# EAGLE design SD_MMC Breakout-v20 (EAGLE 8.1.0)
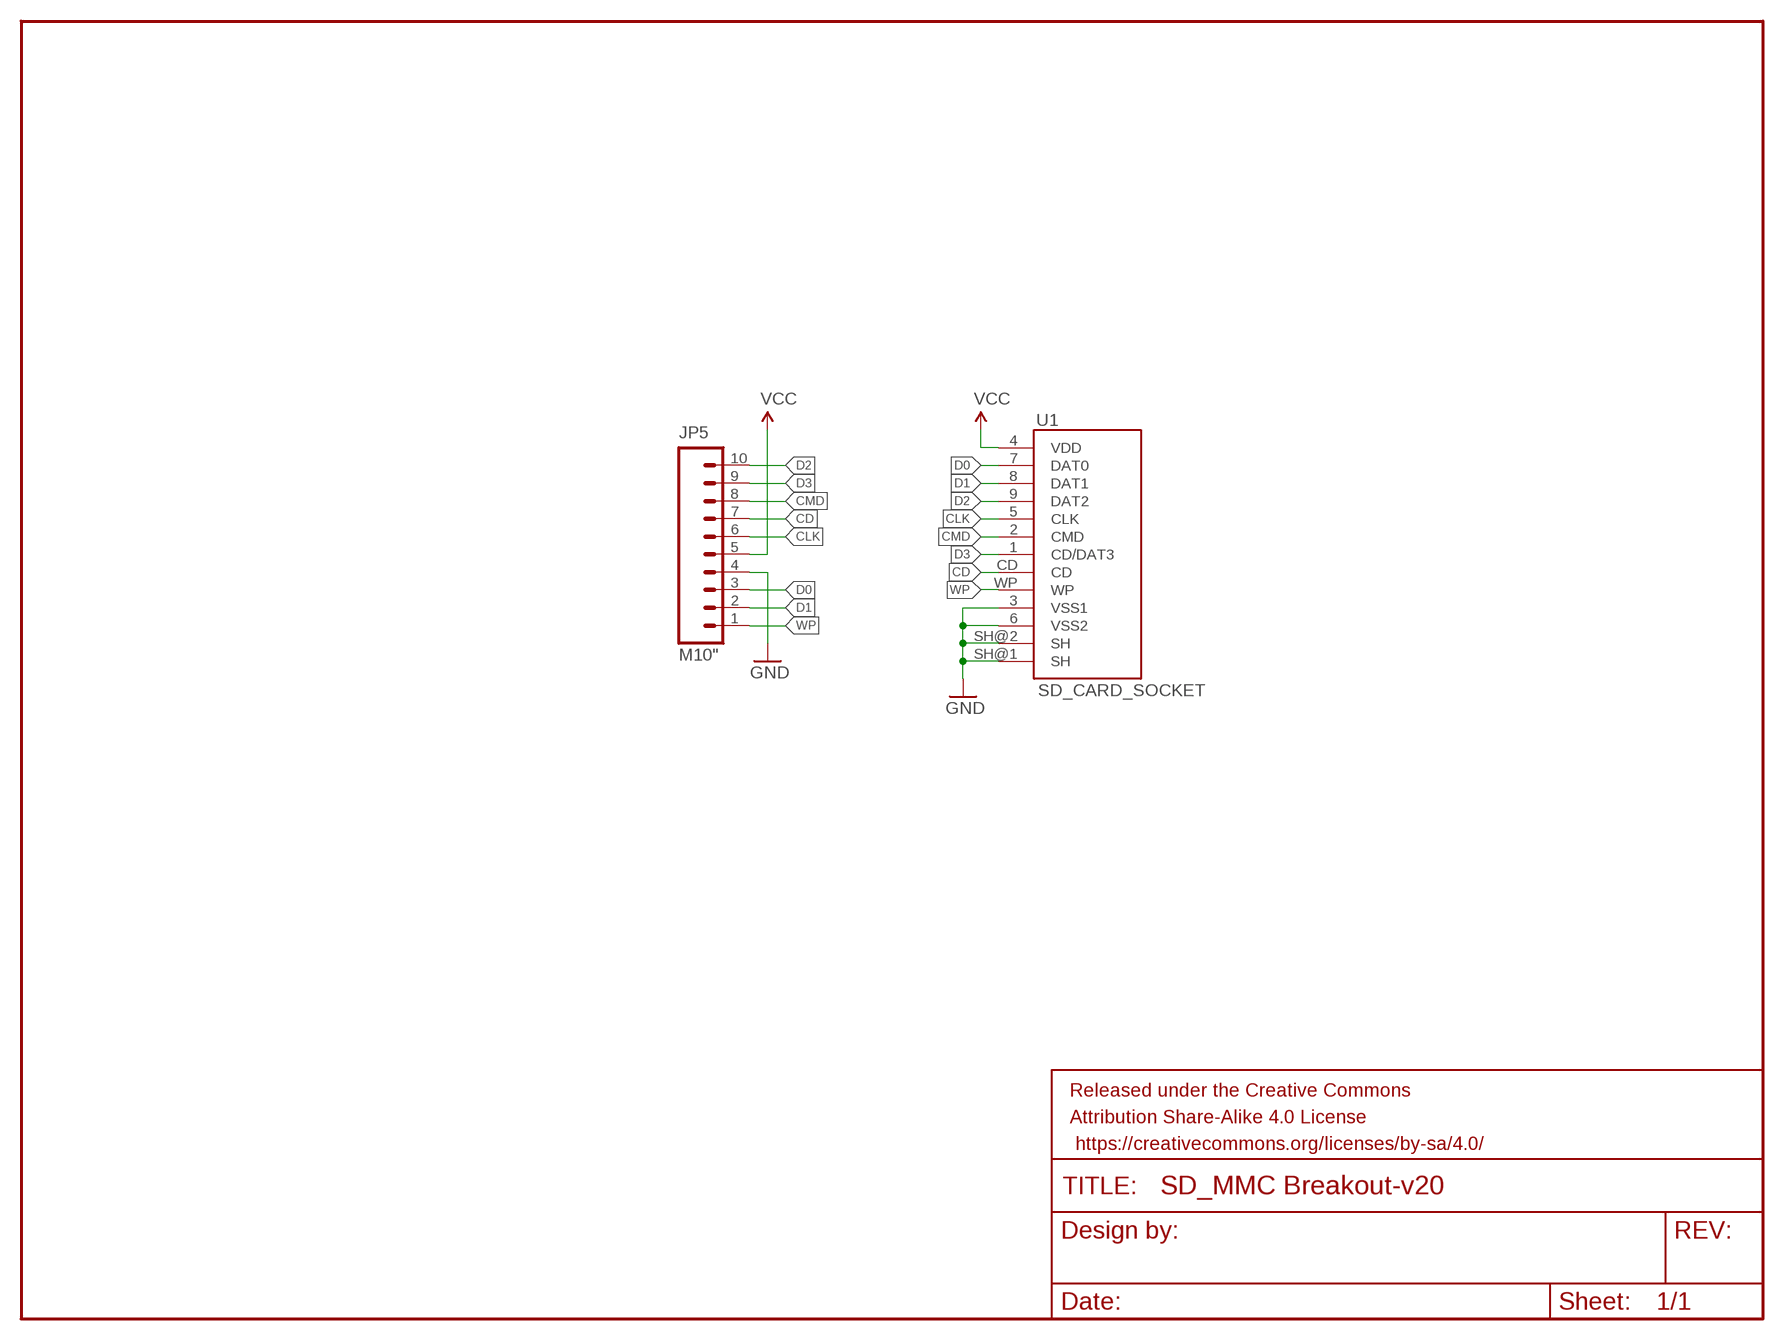
[diagram p0: schematic, sheet 1]

## Parts
FRAME1  FRAME-LETTER  [CREATIVE_COMMONS]
JP5  M10"  [1X10]
U1  SD_CARD_SOCKET  [SD_1:1]

## Nets
CD: JP5.7 U1.CD
CLK: JP5.6 U1.5(CLK)
CMD: JP5.8 U1.2(CMD)
D0: JP5.3 U1.7(DAT0)
D1: JP5.2 U1.8(DAT1)
D2: JP5.10 U1.9(DAT2)
D3: JP5.9 U1.1(CD/DAT3)
GND: JP5.4 U1.3(VSS1) U1.6(VSS2) U1.SH@1(SH) U1.SH@2(SH)
VCC: JP5.5 U1.4(VDD)
WP: JP5.1 U1.WP

## Library data of the parts
FRAME1 = SparkFun-Aesthetics:FRAME-LETTER: Schematic Frame Standard 8.5x11 US Letter frame
JP5 = SparkFun-Connectors:M10: Header 10 Standard 10-pin 0.1" header. Use with straight break away headers (SKU : PRT-00116), right angle break away headers (PRT-00553), swiss pins (PRT-00743), machine pins (PRT-00117), and female headers (PRT-00115).
U1 = SparkFun-Connectors:SD_CARD_SOCKET: SD Memory Card Connector, push-push normal type, CD enable, WP enable

## Board
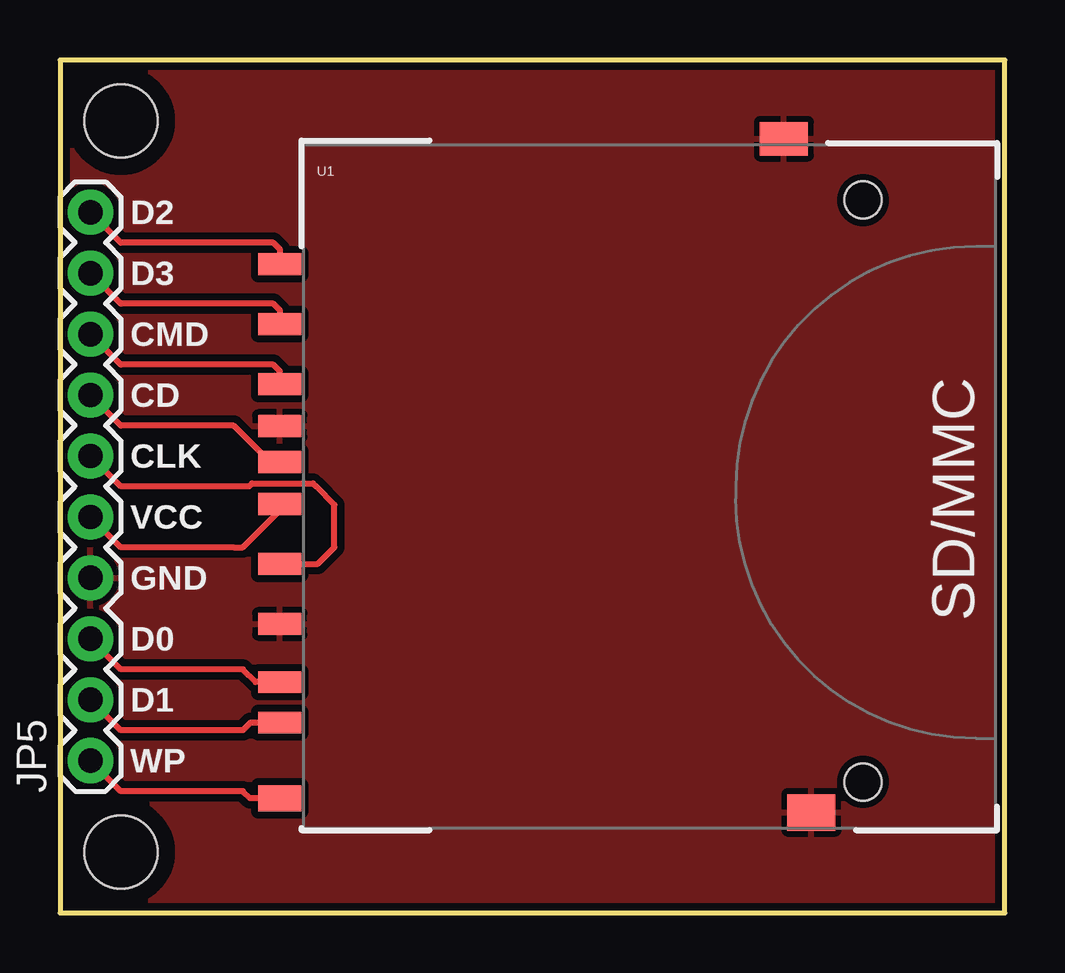
[diagram p1: board, top side]
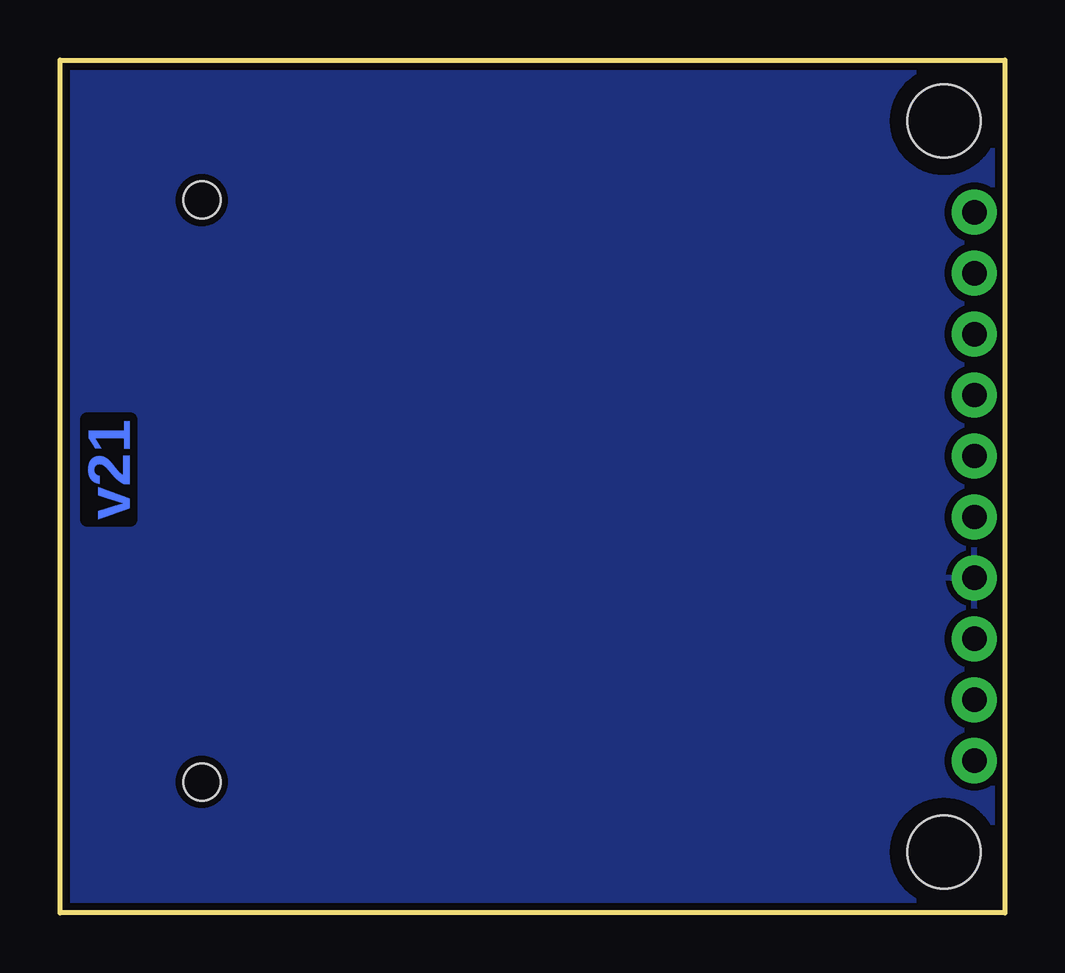
[diagram p2: board, bottom side, seen from below]

Size 39.37 x 35.56 mm. Coordinates in mm from the lower left corner, seen from the top.
Outline: 0,0 39.37,0 39.37,35.56 0,35.56 0,0
Copper layers (1*16): Top 0.0356mm / dielectric 1.5011mm / Bottom 0.0356mm
Design rules "default": minimum track width 8mil, minimum drill 20mil, track to track 8mil, track to pad 8mil, pad to pad 8mil, via to via 8mil, smd to smd 8mil, copper to edge 10mil, drill to drill 8mil, minimum pad ring 12mil, minimum via ring 10mil, stop-mask expansion 4mil, vias tented up to drill 20mil, thermal gap 10mil

### Footprints (pad centres in the part's own frame; a part is rotated, then mirrored left to right if it is on the bottom)
1X10 = drill 1.016 pad 1.88: 1 0,0; 2 2.54,0; 3 5.08,0; 4 7.62,0; 5 10.16,0; 6 12.7,0; 7 15.24,0; 8 17.78,0; 9 20.32,0; 10 22.86,0
SD_1:1 = smd 1.8 x 0.9: 1 -1,6.77; 2 -1,4.27; 3 -1,2.52; 4 -1,-0.73; 5 -1,-3.23; 6 -1,-5.73; 7 -1,-8.15; 8 -1,-9.85; 9 -1,9.27; CD -1,1.02 | smd 2 x 1.4: SH@1 20,14.496 | smd 2 x 1.527: SH@2 21.15,-13.589 | smd 1.8 x 1.1: WP -1,-13 | hole 1.55: 23.3,11.94; 23.3,-12.32
STAND-OFF-TIGHT = hole 3.048: 0,0

### Placement (x,y rotation side)
FRAME1  -1.5,-12.7 0 top  (outside the outline)
JP5  1.27,6.35 90 top
U1  10.16,17.78 0 top
U$4  [STAND-OFF-TIGHT]  2.54,33.02 0 top
U$5  [STAND-OFF-TIGHT]  2.54,2.54 0 top

### Tracks (layer width: path | path; a pad name or v marks a point on that pad's centre or on a via)
CD
  Top 0.254: U1.CD 8.76,18.8 8.26,19.3 7.24,20.32 2.54,20.32 JP5.7
CLK
  Top 0.254: U1.5 10.74,14.55 11.43,15.24 11.43,17.02 10.67,17.78 10.54,17.91 8,17.91 7.87,17.78 2.54,17.78 JP5.6
CMD
  Top 0.254: U1.2 9.16,22.59 8.89,22.86 2.54,22.86 JP5.8
D0
  Top 0.254: U1.7 8.15,9.63 7.62,10.16 2.54,10.16 JP5.3
D1
  Top 0.254: U1.8 7.93,7.93 7.62,7.62 2.54,7.62 JP5.2
D2
  Top 0.254: JP5.10 2.54,27.94 8.89,27.94 9.16,27.67 U1.9
D3
  Top 0.254: JP5.9 2.54,25.4 8.89,25.4 9.16,25.13 U1.1
GND
  pour Bottom (isolate 0.305): 0,35.56 0,0 39.37,0 39.37,35.56
  pour Top (isolate 0.305): 0,35.56 0,0 39.37,0 39.37,35.56
VCC
  Top 0.254: U1.4 9.16,16.78 8.38,16 7.62,15.24 7.24,15.24 2.54,15.24 JP5.5
WP
  Top 0.254: U1.WP 7.92,4.78 7.62,5.08 2.54,5.08 JP5.1

### Text on the board
Bottom: v21
tPlace: D2 | D3 | CMD | CD | CLK | VCC | GND | SD/MMC | D0 | D1 | WP
tDocu: A. Weiss | Revised by: Patrick Alberts